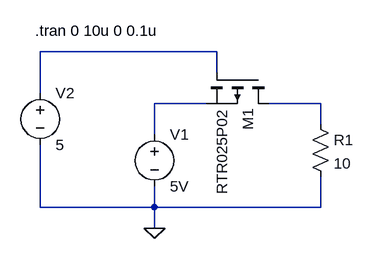
[diagram p0: schematic Draft3.asc]
Draft3.asc, the LTspice schematic file:
Version 4
SHEET 1 880 680
WIRE 288 48 16 48
WIRE 288 80 288 48
WIRE 16 112 16 48
WIRE 272 128 192 128
WIRE 448 128 368 128
WIRE 448 160 448 128
WIRE 192 176 192 128
WIRE 16 288 16 192
WIRE 192 288 192 256
WIRE 192 288 16 288
WIRE 448 288 448 240
WIRE 448 288 192 288
WIRE 192 320 192 288
FLAG 192 320 0
SYMBOL voltage 16 96 R0
WINDOW 123 0 0 Left 2
WINDOW 39 0 0 Left 2
SYMATTR InstName V2
SYMATTR Value 5
SYMBOL voltage 192 160 R0
WINDOW 123 0 0 Left 2
WINDOW 39 0 0 Left 2
SYMATTR InstName V1
SYMATTR Value 5V
SYMBOL pmos 368 80 R90
SYMATTR InstName M1
SYMATTR Value RTR025P02
SYMBOL res 432 144 R0
SYMATTR InstName R1
SYMATTR Value 10
TEXT 8 16 Left 2 !.tran 0 10u 0 0.1u

The netlist it stands for:
* Draft3.asc
V2 N001 0 5
V1 N002 0 5V
M1 N003 N001 N002 N002 RTR025P02
R1 N003 0 10
.model NMOS NMOS
.model PMOS PMOS
.lib standard.mos
.tran 0 10u 0 0.1u
.backanno
.end